# EAGLE design battery_buzzer_changes (EAGLE 7.4.0)
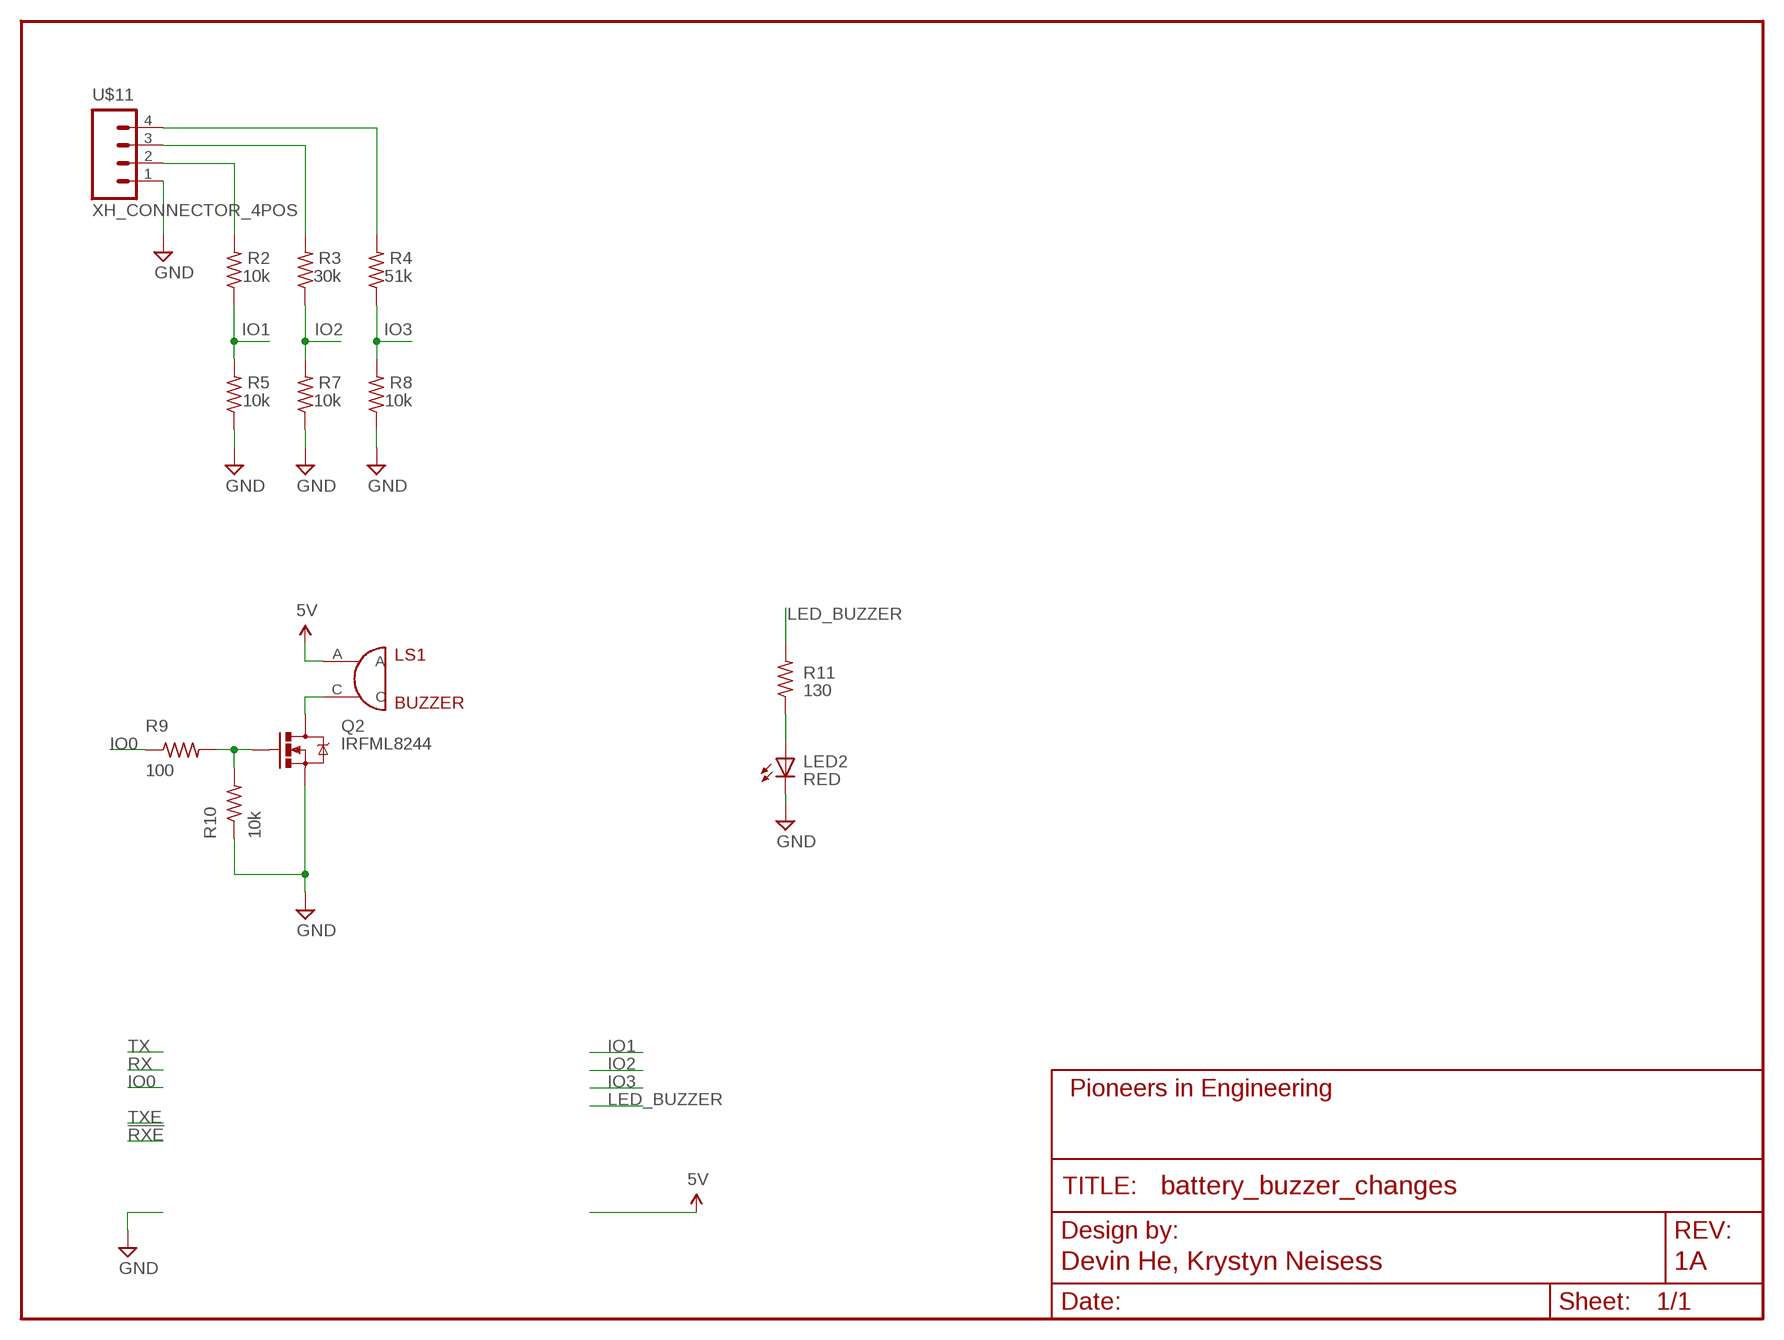
[diagram p0: schematic, sheet 1]
FRAME1 (FRAME-LETTER): AUTHOR: Devin He, Krystyn Neisess; REVISION: 1A

## Parts
LED2  RED  LED0805  [LED-0805]
LS1  BUZZER  [BUZZER_MAGNETIC_5V_12MM_RADIAL]
Q2  IRFML8244  MOSFET-NCHANNELSMD  [SOT23-3]
R2  10k  R-US_R0603  [R0603]
R3  30k  R-US_R0603  [R0603]
R4  51k  R-US_R0603  [R0603]
R5  10k  R-US_R0603  [R0603]
R7  10k  R-US_R0603  [R0603]
R8  10k  R-US_R0603  [R0603]
R9  100  R-US_R0603  [R0603]
R10  10k  R-US_R0603  [R0603]
R11  130  R-US_R0603  [R0603]
U$11  XH_CONNECTOR_4POS  [XH_CONNECTOR_4POS_2.5MM]

## Nets
5V: LS1.A
GND: LED2.C Q2.2(S) R5.1 R7.1 R8.1 R10.1 U$11.1
IO0: R9.1
IO1: R2.1 R5.2
IO2: R3.1 R7.2
IO3: R4.1 R8.2
LED_BUZZER: R11.2
N$1: R2.2 U$11.2
N$2: R3.2 U$11.3
N$4: R4.2 U$11.4
N$5: LS1.C Q2.3(D)
N$6: Q2.1(G) R9.2 R10.2
N$7: LED2.A R11.1

## Library data of the parts
LED2 = pie:LED: LEDs Standard schematic elements and footprints for 5mm, 3mm, 1206, and 0603 sized LEDs. 5mm - Spark Fun Electronics SKU : COM-00529 (and others); PIE-INT-REF-NUM: LED
LS1 = pie:BUZZER: Buzzer; PIE-INT-REF-NUM: BUZZER; PIE_DIGIKEY-PN: 102-1269-ND
Q2 = pie:MOSFET-NCHANNEL: N-Type MOSFET, SOT23-3 Package; PIE-INT-REF-NUM: NMOS
R2-R5 R7-R11 = pie:R-US_: RESISTOR, American symbol; PIE-INT-REF-NUM: RESISTOR-GENERIC
U$11 = pie:XH_CONNECTOR_4POS: 4-pin XH connector (through-hole type shrouded header); PIE-INT-REF-NUM: XH-4POS; PIE_DIGIKEY-PN: 455-2249-ND

## Board
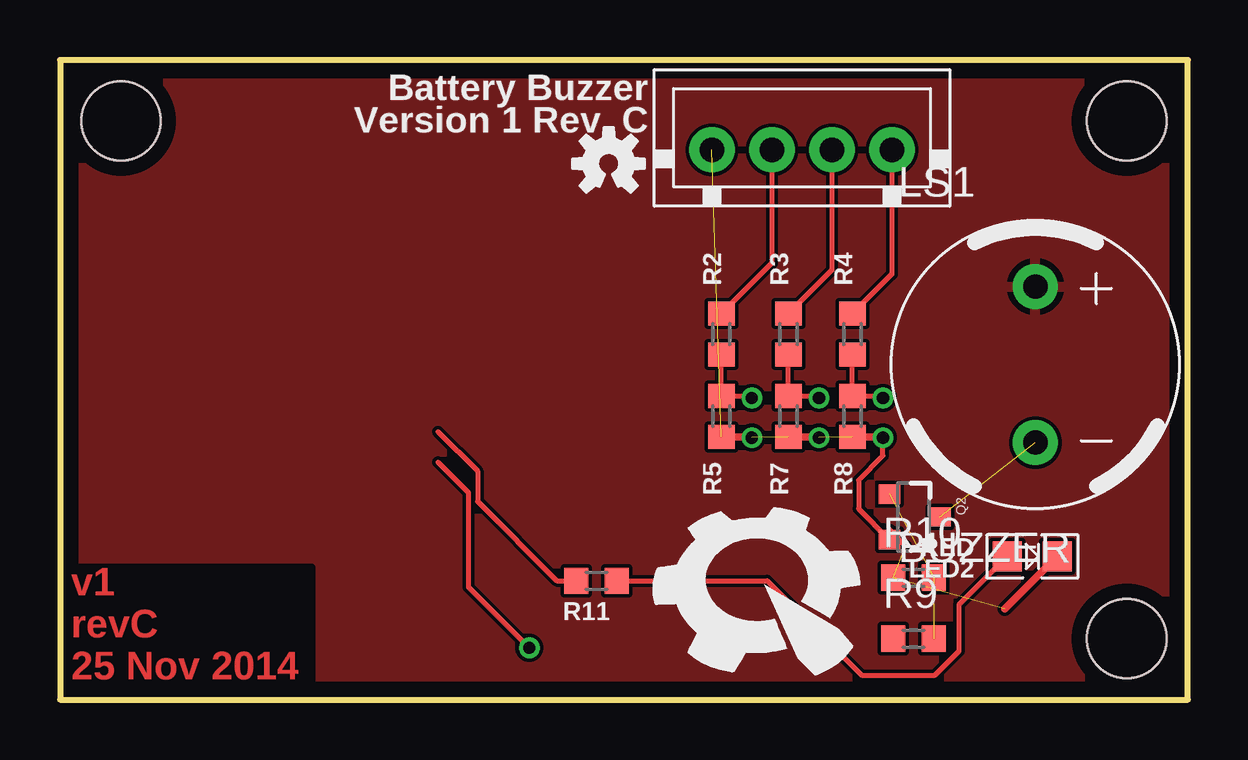
[diagram p1: board, top side]
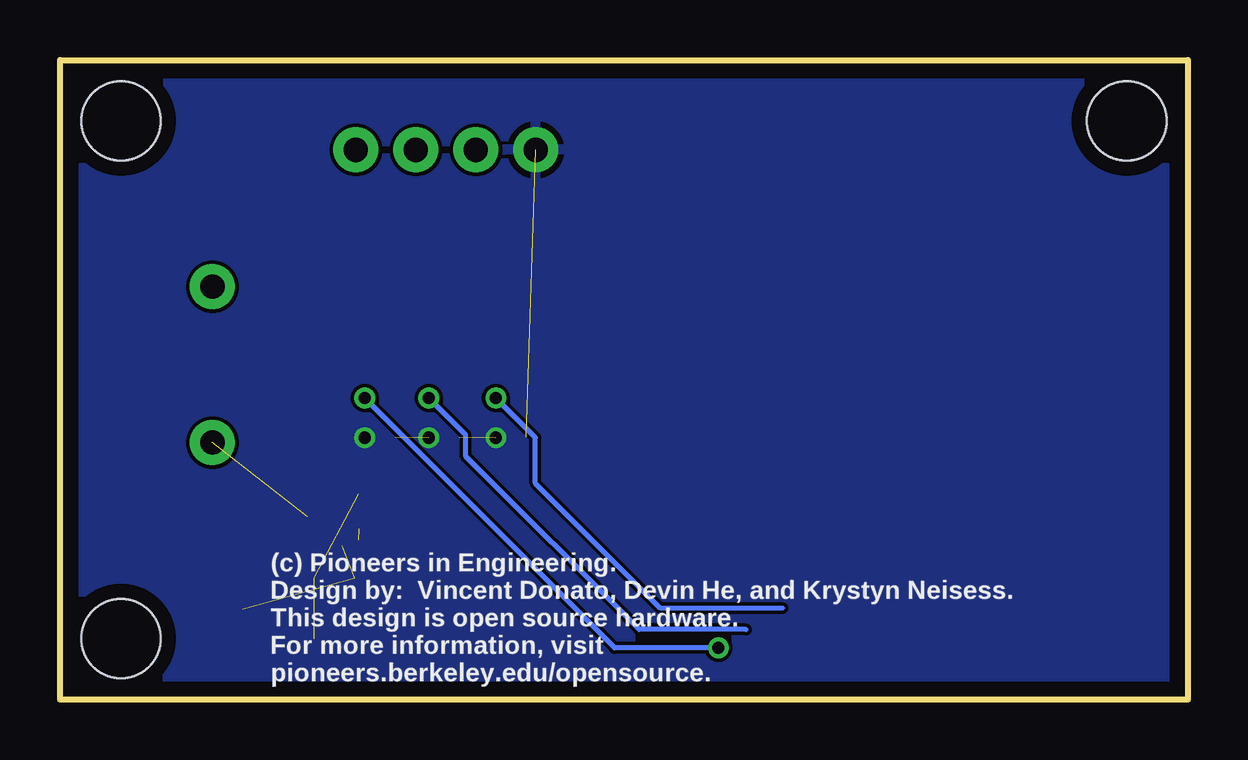
[diagram p2: board, bottom side, seen from below]

Size 46.99 x 26.67 mm. Coordinates in mm from the lower left corner, seen from the top.
Outline: 0,0 46.99,0 46.99,26.67 0,26.67 0,0
Copper layers (1*16): Top 2mil / dielectric 9mil / Bottom 2mil
Design rules "advancedcircuits-33each-pie": minimum track width 6mil, minimum drill 15mil, track to track 6mil, track to pad 6mil, pad to pad 6mil, via to via 6mil, smd to smd 6mil, copper to edge 25mil, drill to drill 7mil, minimum pad ring 7mil, minimum via ring 7mil, stop-mask expansion 3mil, vias tented up to drill 21mil, thermal gap 10mil

### Footprints (pad centres in the part's own frame; a part is rotated, then mirrored left to right if it is on the bottom)
LED-0805 = smd 1.194 x 1.245: A -1.041,0; C 1.041,0
BUZZER_MAGNETIC_5V_12MM_RADIAL = drill 1.016 pad 1.88: A 0,3.25; C 0,-3.25
SOT23-3 = smd 0.8 x 0.9: 1 -0.95,-1; 2 0.95,-1; 3 0,1.1
R0603 = smd 1 x 1.1: 1 -0.85,0; 2 0.85,0
STAND-OFF = hole 3.302: 0,0
XH_CONNECTOR_4POS_2.5MM = drill 1.016 pad 1.88: 1 -3.95,-0.19; 2 -1.45,-0.19; 3 1.05,-0.19; 4 3.55,-0.19

### Placement (x,y rotation side)
LED2  40.51,5.97 0 top
LS1  40.64,13.97 0 top
Q2  35.56,7.62 270 top
R2  27.56,15.24 90 top
R3  30.35,15.24 90 top
R4  33.02,15.24 90 top
R5  27.56,11.81 90 top
R7  30.35,11.81 90 top
R8  33.02,11.81 90 top
R9  35.56,2.54 0 top
R10  35.56,5.08 0 top
R11  22.35,4.95 180 top
U$1  [PIE-LOGO-SMALL]  29.34,4.83 0 top
U$7  [OSHW-LOGO-S]  22.86,22.35 0 top
U$8  [STAND-OFF]  2.54,24.13 0 top
U$9  [STAND-OFF]  44.45,24.13 0 top
U$11  31.11,23.11 0 top
U$17  [STAND-OFF]  44.45,2.54 0 top

### Tracks (layer width: path | path; a pad name or v marks a point on that pad's centre or on a via)
5V
  pour Top: 0,0 0,26.67 46.99,26.67 46.99,0
GND  (via drill 0.51)  (6 unrouted)
  Top 0.203: 35.24,6.42 34.54,7.11 | v34.29,10.92 34.29,10.16 33.27,9.14 33.27,7.96 Q2.2
  Top 0.305: R5.1 28.79,10.96 v28.83,10.92 | R7.1 31.58,10.96 v31.62,10.92 | R8.1 34.25,10.96 v34.29,10.92 | 39.37,3.79 LED2.C
  pour Bottom: 0,0 0,26.67 46.99,26.67 46.99,0
IO1  (via drill 0.51)
  Top 0.203: v28.83,12.57 28.74,12.66 R5.2 R2.1
  Bottom 0.203: 16.89,3.81 21.97,3.81 27.18,9.02 27.18,10.92 v28.83,12.57
IO2  (via drill 0.51)
  Top 0.203: v31.62,12.57 31.54,12.66 R7.2 R3.1
  Bottom 0.203: 18.41,2.92 22.86,2.92 30.1,10.16 30.1,11.05 v31.62,12.57
IO3  (via drill 0.51)
  Top 0.203: 15.75,9.91 17.02,8.64 17.02,4.7 v19.56,2.16 | R4.1 R8.2 34.2,12.66 v34.29,12.57
  Bottom 0.203: v19.56,2.16 23.88,2.16 v34.29,12.57
LED_BUZZER
  Top 0.203: 15.75,11.18 17.4,9.53 17.4,8.26 20.7,4.95 R11.2
N$1
  Top 0.203: U$11.2 29.66,18.2 R2.2
N$2
  Top 0.203: U$11.3 32.16,17.9 R3.2
N$4
  Top 0.203: U$11.4 34.66,17.73 R4.2
N$5  (1 unrouted)
N$6  (2 unrouted)
N$7
  Top 0.203: R11.1 29.46,4.95 33.4,1.02 36.45,1.02 37.47,2.03 37.47,3.96 LED2.A 39.37,5.87

### Text on the board
Top: v1 / revC / 25 Nov 2014
tPlace: Battery Buzzer / Version 1 Rev. C
bPlace: (c) Pioneers in Engineering. / Design by: Vincent Donato, Devin He, and Krystyn Neisess. / This design is open source hardware. / For more information, visit / pioneers.berkeley.edu/opensource.
tValues: 10k | 130